# Altium schematic sheet POWER_SUPPLY ATX24_PIN_SCH.SchDoc
size A; SheetNumber: 2; SheetTotal: 2
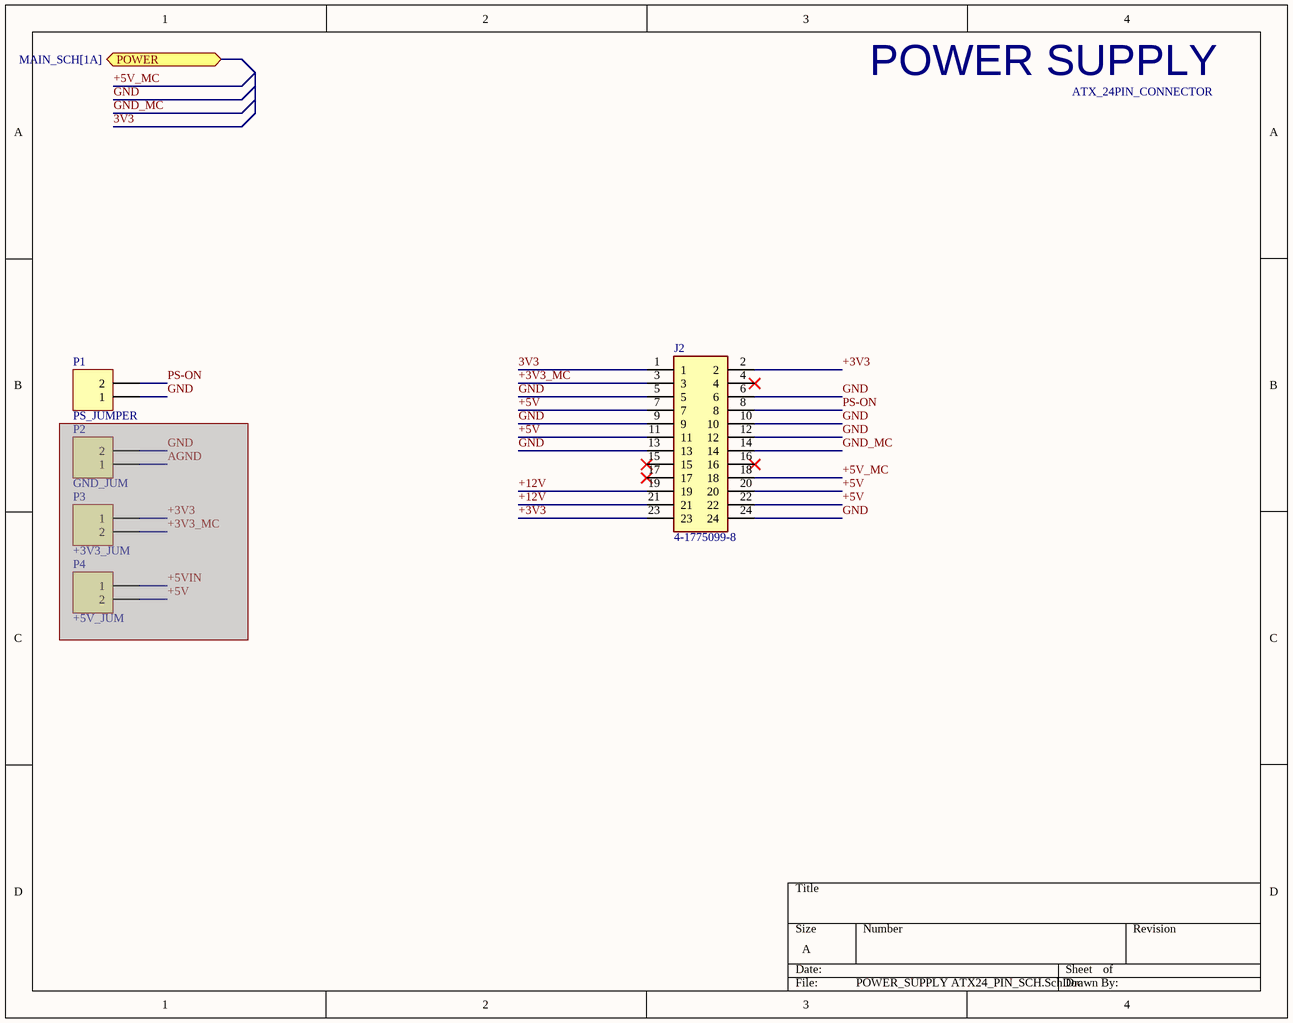
[diagram p0: POWER_SUPPLY ATX24_PIN_SCH.SchDoc]

## Parts
J2  4-1775099-8  [TE_4-1775099-8]
P1  PS_JUMPER  [HDR1X2]
P2  GND_JUM  [HDR1X2]  (masked out: inside a compile mask, not in the netlist)
P3  +3V3_JUM  [HDR1X2]  (masked out: inside a compile mask, not in the netlist)
P4  +5V_JUM  [HDR1X2]  (masked out: inside a compile mask, not in the netlist)

## Ports
POWER (bidir, see MAIN_SCH[1A])

## Nets
3V3: J2.1
+3V3: J2.2 J2.23
+3V3_MC: J2.3
+5V: J2.7 J2.11 J2.20 J2.22
+5V_MC: J2.18
+12V: J2.19 J2.21
GND: J2.5 J2.6 J2.9 J2.10 J2.12 J2.13 J2.24 P1.1
GND_MC: J2.14
PS-ON: J2.8 P1.2

Not connected (* = marked no-connect by the designer): J2 4* 15* 16* 17*

## Notes on the sheet
- POWER SUPPLY
- ATX_24PIN_CONNECTOR

## Library data of the parts
J2 = 4-1775099-8: Conn Power PL 24 POS 4.2mm Solder ST Thru-Hole 4 Terminal 1 Port Tray; Package: None; Price: None; Value: *; MP: 4-1775099-8; Availability: Unavailable
P1-P4 = Header 2: Header, 2-Pin; LatestRevisionDate: 17-Jul-2002; LatestRevisionNote: Re-released for DXP Platform.; Publisher: Altium Limited